# EAGLE design StepperDriver (EAGLE 7.2.0)
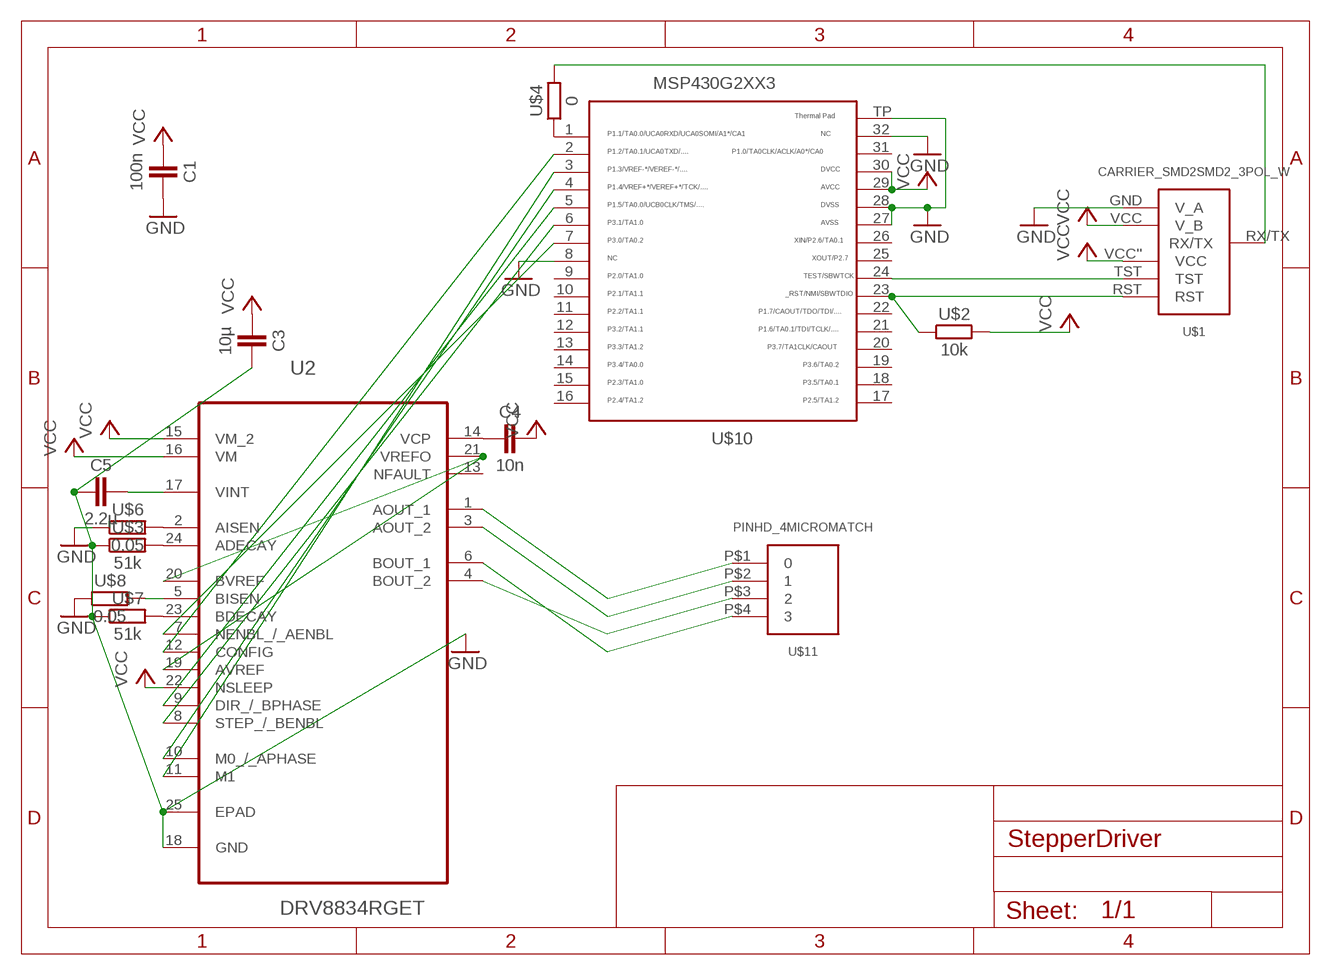
[diagram p0: schematic, sheet 1]

## Parts
C1  100n  CAPACITOR  [603]
C3  10µ  CAPACITOR  [603]
C4  10n  CAPACITOR  [603]
C5  2.2µ  CAPACITOR  [603]
U2  DRV8834RGET  [QFN50P400X400X100-25N]
U$1  CARRIER_SMD2SMD2_3POL_W  [CARRIER_SMD2_WIDE_3POL]
U$2  10k  RESISTOR0603  [603]
U$3  51k  RESISTOR0603  [603]
U$4  0  RESISTOR0603  [603]
U$6  0.05  RESISTOR0603  [603]
U$7  51k  RESISTOR0603  [603]
U$8  0.05  RESISTOR0603  [603]
U$10  MSP430G2553  [QFN32]
U$11  PINHD_4MICROMATCH  [MICROMATCH4P0L]

## Nets
GND: C1.2 C3.2 C5.1 U2.18(GND) U2.25(EPAD) U$1.GND(V_A) U$3.1 U$6.1 U$7.1 U$8.1 U$10.8 U$10.27 U$10.28 U$10.32 U$10.TP
N$2: C5.2 U2.17(VINT)
N$3: U$1.TST U$10.24
N$4: U$1.RST U$2.1 U$10.23
N$5: C4.1 U2.14(VCP)
N$6: U2.24(ADECAY) U$3.2
N$7: U2.23(BDECAY) U$7.2
N$11: U$4.1 U$10.1
N$12: U$1.RX/TX U$4.2
N$13: U2.2(AISEN) U$6.2
N$14: U2.5(BISEN) U$8.2
N$16: U2.6(BOUT_1) U$11.P$4
N$18: U2.4(BOUT_2) U$11.P$3
N$23: U2.1(AOUT_1) U$11.P$1
N$24: U2.3(AOUT_2) U$11.P$2
N$27: U2.19(AVREF) U2.20(BVREF) U2.21(VREFO)
N$29: U2.10(M0_/_APHASE) U$10.4
N$32: U2.11(M1) U$10.3
N$34: U2.7(NENBL_/_AENBL) U$10.7
N$35: U2.8(STEP_/_BENBL) U$10.6
N$36: U2.12(CONFIG) U$10.2
N$37: U2.9(DIR_/_BPHASE) U$10.5
VCC: C1.1 C3.1 C4.2 U2.15(VM_2) U2.16(VM) U2.22(NSLEEP) U$1.VCC''(VCC) U$1.VCC(V_B) U$2.2 U$10.29 U$10.30
Unconnected: U2.13(NFAULT) U$10.9 U$10.10 U$10.11 U$10.12 U$10.13 U$10.14 U$10.15 U$10.16 U$10.17 U$10.18 U$10.19 U$10.20 U$10.21 U$10.22 U$10.25 U$10.26 U$10.31

## Library data of the parts
C1 C3-C5 = thar:CAPACITOR
U2 = DRV8834_QFN:DRV8834RGET: DUAL BRIDGE STEPPER OR DC MOTOR DRIVER,QFN-24; MPN: DRV8834RGET; OC_FARNELL: 2144264; OC_NEWARK: 27W5089; PACKAGE: QFN-24; SUPPLIER: TEXAS INSTRUMENTS
U$1 = thar:CARRIER_SMD2
U$2-U$4 U$6-U$8 = thar:RESISTOR
U$10 = thar:MSP430G2553: TEXAS INSTRUMENTS MSP430G2553IRHB32R MCU, 16BIT, MSP430, 16MHZ, QFN-32 Farnell Best.Nr.: 2325726 Herst.Bez.: MSP430G2553IRHB32R
U$11 = thar:PINHD_4

## Board
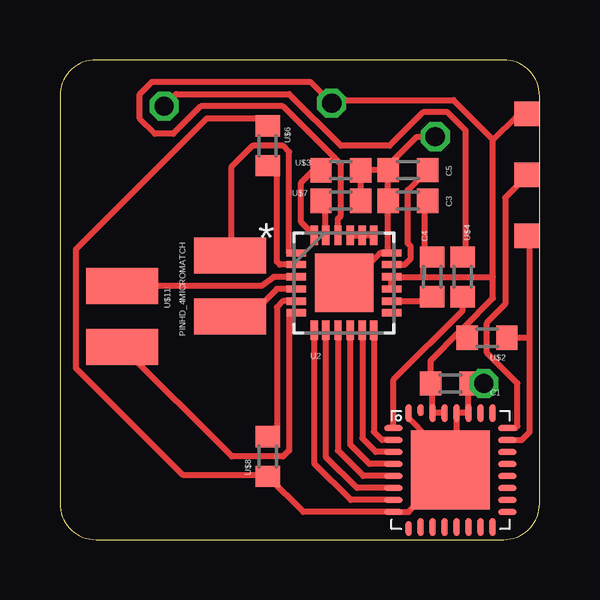
[diagram p1: board, top side]
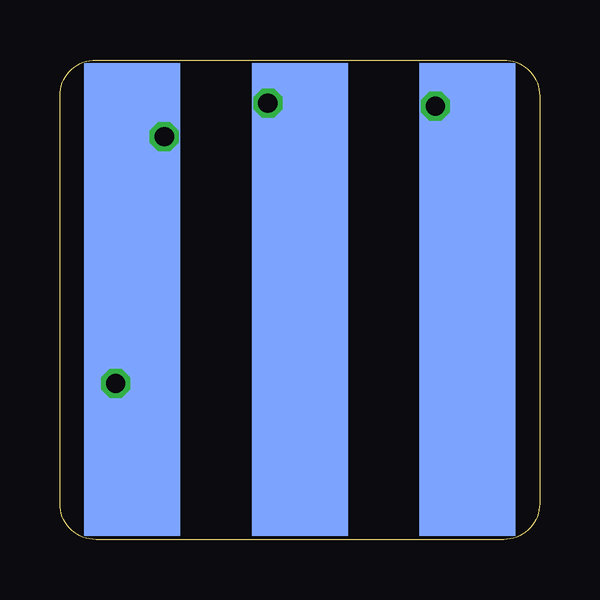
[diagram p2: board, bottom side, seen from below]

Size 20 x 20 mm. Coordinates in mm from the lower left corner, seen from the top.
Copper layers (1*16): Top 0.035mm / dielectric 1.5mm / Bottom 0.035mm
Design rules "Bilex DRU *": minimum track width 10mil, minimum drill 24mil, track to track 10mil, track to pad 10mil, pad to pad 10mil, via to via 10mil, smd to smd 10mil, copper to edge 1mil, drill to drill 8mil, minimum pad ring 10mil, minimum via ring 8mil, stop-mask expansion 4mil, vias tented up to drill 0mil, thermal gap 10mil

### Footprints (pad centres in the part's own frame; a part is rotated, then mirrored left to right if it is on the bottom)
603 = smd 0.889 x 1.016: 1 -0.826,0; 2 0.826,0
QFN50P400X400X100-25N = smd 0.813 x 0.305: 1 -1.981,1.245; 2 -1.981,0.762; 3 -1.981,0.254; 4 -1.981,-0.254; 5 -1.981,-0.762; 6 -1.981,-1.245; 13 1.981,-1.245; 14 1.981,-0.762; 15 1.981,-0.254; 16 1.981,0.254; 17 1.981,0.762; 18 1.981,1.245 | smd 0.305 x 0.813: 7 -1.245,-1.981; 8 -0.762,-1.981; 9 -0.254,-1.981; 10 0.254,-1.981; 11 0.762,-1.981; 12 1.245,-1.981; 19 1.245,1.981; 20 0.762,1.981; 21 0.254,1.981; 22 -0.254,1.981; 23 -0.762,1.981; 24 -1.245,1.981 | smd 2.438 x 2.438: 25 0,0
CARRIER_SMD2_WIDE_3POL = smd 4 x 19.7 bottom: GND -6.985,3.493; RX/TX 6.985,3.493; VCC 0,3.493 | smd 1.016 x 1.016: RST -9.461,0.826; TST -9.461,-1.714; VCC'' -9.461,-4.255
QFN32 = smd 0.762 x 0.254: 1 -2.375,1.75; 2 -2.375,1.25; 3 -2.375,0.75; 4 -2.375,0.25; 5 -2.375,-0.25; 6 -2.375,-0.75; 7 -2.375,-1.25; 8 -2.375,-1.75; 17 2.375,-1.75; 18 2.375,-1.25; 19 2.375,-0.75; 20 2.375,-0.25; 21 2.375,0.25; 22 2.375,0.75; 23 2.375,1.25; 24 2.375,1.75 | smd 0.254 x 0.635: 9 -1.75,-2.438 | smd 0.254 x 0.762: 10 -1.25,-2.375; 11 -0.75,-2.375; 12 -0.25,-2.375; 13 0.25,-2.375; 14 0.75,-2.375; 15 1.25,-2.375; 16 1.75,-2.375; 25 1.75,2.375; 26 1.25,2.375; 27 0.75,2.375; 28 0.25,2.375; 29 -0.25,2.375; 30 -0.75,2.375; 32 -1.75,2.375 | smd 0.254 x 0.508: 31 -1.25,2.5 | smd 3.302 x 3.302: TP 0,0
MICROMATCH4P0L = smd 1.5 x 3: P$1 -1.905,2.25; P$2 -0.635,-2.25; P$3 0.635,2.25; P$4 1.905,-2.25

### Placement (x,y rotation side)
C1  16.28,6.51 0 top
C3  14.51,14.13 180 top
C4  15.52,10.96 90 top
C5  14.51,15.41 0 top
U2  11.85,10.7 0 top
U$1  10,13.5 180 top
U$2  17.81,8.42 180 top
U$3  11.71,15.4 180 top
U$4  16.79,10.96 90 top
U$6  8.66,16.42 270 top
U$7  11.71,14.13 180 top
U$8  8.67,3.46 90 top
U$10  16.28,2.9 0 top
U$11  4.85,9.94 270 top

### Tracks (layer width: path | path; a pad name or v marks a point on that pad's centre or on a via)
GND  (via drill 0.8)
  Top 0.254: 16.53,4.23 U$10.28 U$10.27 17.03,6.44 C1.2 16.98,6.7 16.98,6.45 v17.68,6.51 | 16.53,4.23 16.53,3.15 U$10.TP 14.53,1.15 U$10.8 10.15,1.15 U$8.1 8.6,2.7 5.11,2.7 0.66,7.15 0.66,12.1 6.12,17.56 8.66,17.56 U$6.1 | U$10.32 14.53,5.09 15.39,4.23 16.53,4.23 | U$3.1 U$7.1 U$3.1 C5.1 | C3.2 C5.1 | U2.25 12.35,11.21 12.6,11.21 13.34,11.95 U2.18 13.68,11.95 C5.1 | C5.1 13.68,15.59 14.89,16.8 v15.65,16.8
  Bottom 0.254: v17.68,6.51 17.17,9.82 U$1.GND 16.86,10.13 16.86,15.59 v15.65,16.8
N$2
  Top 0.254: U2.17 14.38,11.46 14.63,11.72 14.63,12.23 14.51,12.35 14.51,14.58 C5.2
N$3
  Top 0.254: U$10.24 19,4.65 19.08,4.73 19.08,6.51 17.81,7.78 17.81,9.05 18.57,9.81 18.57,14.26 19.46,15.15 U$1.TST
N$4
  Top 0.254: U$10.23 19.26,4.15 19.59,4.48 19.59,8.42 | 19.59,8.42 19.59,12.67 U$1.RST | U$2.1 19.32,8.43 19.59,8.42
N$5
  Top 0.254: U2.14 15.33,9.94 C4.1
N$6
  Top 0.254: U$3.2 10.82,15.65 10.06,14.89 10.06,13.24 10.6,12.7 U2.24
N$7
  Top 0.254: 10.96,14.07 U$7.2 11.08,13.93 U2.23
N$11
  Top 0.254: U$10.1 13.91,6.68 16.79,9.56 U$4.1
N$12  (via drill 0.8)
  Top 0.254: U$4.2 16.73,11.78 16.92,11.97 16.92,17.05 16.16,17.81 15.14,17.81 13.74,16.42 11.71,16.42 9.55,18.58 4.85,18.58 v4.35,18.07
  Bottom 0.254: v4.35,18.07 3.01,17.88 U$1.RX/TX 3.01,6.64
N$13
  Top 0.254: U2.2 9.17,11.46 9.04,11.59 9.04,15.21 U$6.2
N$14
  Top 0.254: U2.5 9.3,9.94 9.04,9.69 9.04,4.67 U$8.2
N$16
  Top 0.254: U2.6 9.55,9.46 9.55,3.72 9.3,3.46 7.18,3.46 U$11.P$4
N$18
  Top 0.254: U2.4 9.04,10.45 7.9,9.31 U$11.P$3
N$23
  Top 0.254: U2.1 9.55,11.95 9.55,16.16 9.3,16.42 8.03,16.42 7.14,15.53 7.14,11.88 U$11.P$1
N$24
  Top 0.254: U2.3 8.92,10.96 8.41,10.58 U$11.P$2
N$27
  Top 0.254: U2.19 U2.20 U2.21
N$29
  Top 0.254: U$10.4 12.91,3.15 12.1,3.97 U2.10
N$32
  Top 0.254: U$10.3 13.18,3.65 12.61,4.22 U2.11
N$34
  Top 0.254: U$10.7 12.13,1.65 10.6,3.18 U2.7
N$35
  Top 0.254: U$10.6 12.39,2.15 11.08,3.46 U2.8
N$36
  Top 0.254: U2.12 13.09,4.5 13.44,4.15 U$10.2
N$37
  Top 0.254: U$10.5 12.65,2.65 11.59,3.71 U2.9
VCC  (via drill 0.8)
  Top 0.254: U$10.29 U$10.30 15.53,6.44 C1.1 15.46,7.46 16.66,8.67 | 19.5,17.65 19.46,17.69 | 19.2,17.69 19.2,17.63 | 19.2,17.63 19.46,17.69 | 19.46,17.69 19.65,17.88 19.65,18.13 19.59,18.07 19.46,18.07 19.2,17.81 19.4,17.94 U$1.VCC'' | 19.08,17.81 19.46,18.01 U$1.VCC'' | U2.15 U2.16 15.14,10.96 | 19.2,17.63 19.2,17.7 | U2.22 11.59,13.38 11.71,13.5 11.71,15.66 9.3,18.07 5.87,18.07 4.73,16.93 3.96,16.93 3.33,17.56 3.33,18.58 3.84,19.09 10.44,19.09 v11.33,18.2 11.33,18.32 16.41,18.32 18.06,16.67 | 19.52,17.81 U$1.VCC'' | 16.66,8.67 16.79,8.8 | 18.06,10.96 18.06,10.07 16.79,8.8 | 18.06,10.96 18.06,16.67 | 16.79,8.8 16.92,8.16 17.17,8.42 17.07,8.47 | 17.07,8.47 16.66,8.67 | C3.1 15.2,14 15.2,12.1 C4.2 15.2,11.78 15.14,11.72 15.14,10.96 | 15.14,10.96 18.06,10.96 | U$2.2 17.02,8.42 17.07,8.47 | 19.2,17.63 19.02,17.63 18.06,16.67
  Bottom 0.254: U$1.VCC 10,18.9 v11.33,18.2